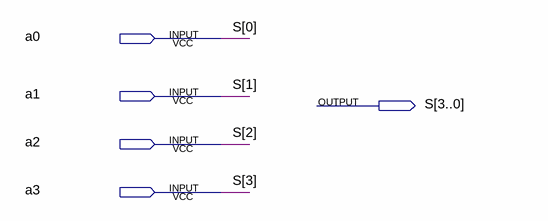
[diagram p0: schematic sheet]
// Quartus schematic BusEncoder4.bdf as structural Verilog: 0 symbols, 5 pins
module BusEncoder4 (
  input  a0,
  input  a1,
  input  a2,
  input  a3,
  output [3:0] S
);


  assign S = {a3, a2, a1, a0};
endmodule
